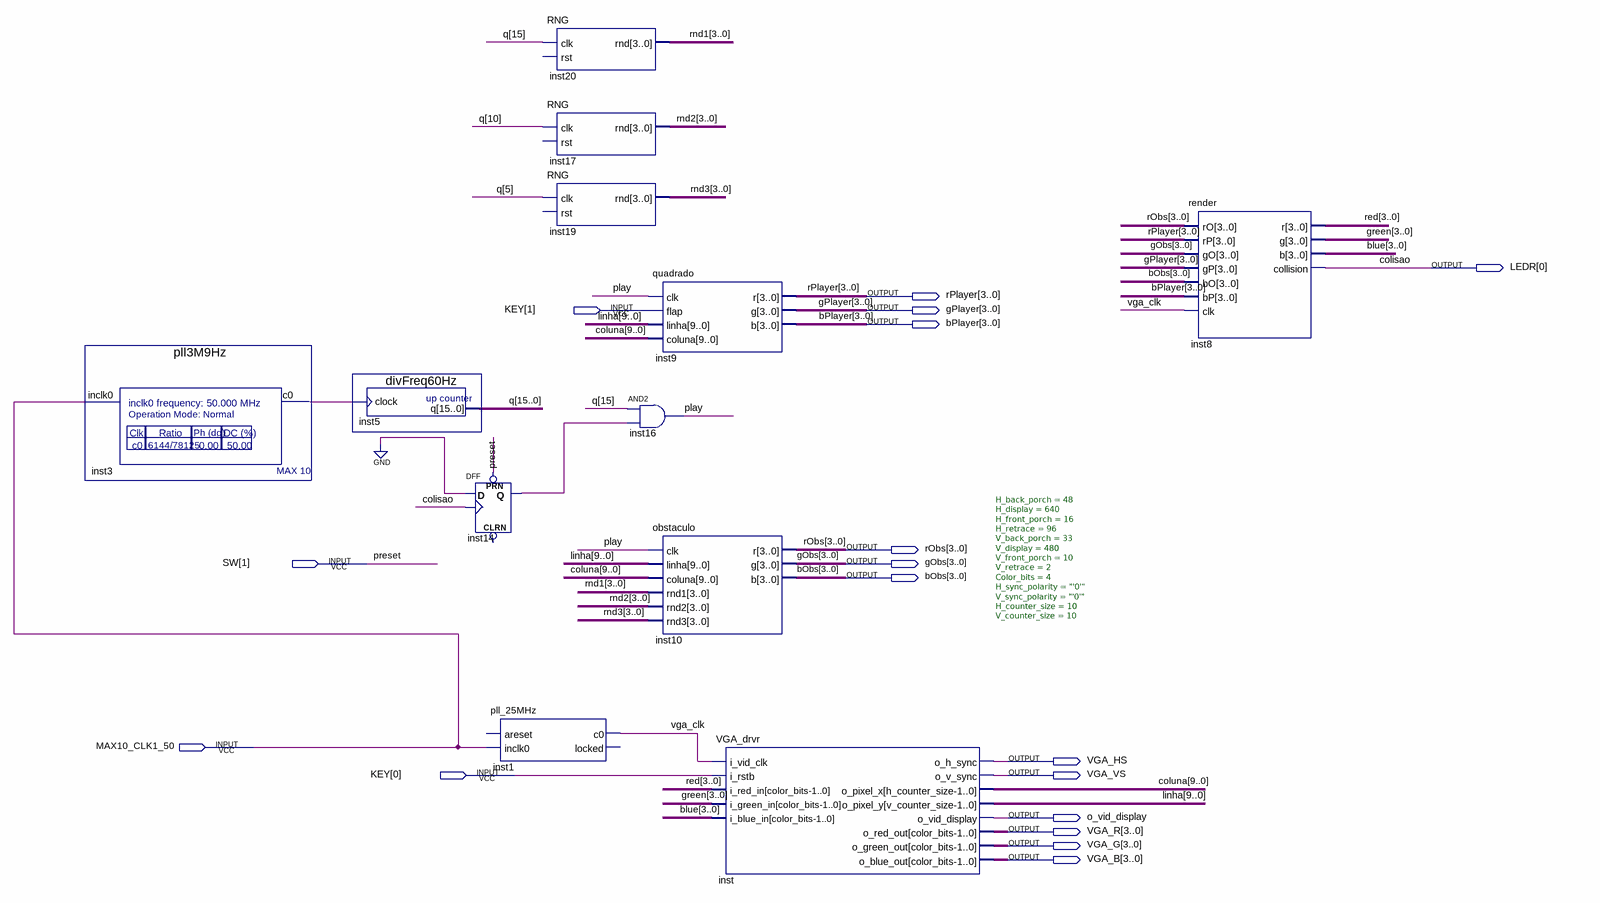
[diagram p0: schematic sheet]
// Quartus schematic vga1.bdf as structural Verilog: 12 symbols, 17 pins
module vga1 (
  input  [1:0] KEY,
  input  [1:1] SW,
  input  MAX10_CLK1_50,
  output [0:0] LEDR,
  output [3:0] rPlayer,
  output [3:0] gPlayer,
  output [3:0] bPlayer,
  output [3:0] rObs,
  output [3:0] gObs,
  output [3:0] bObs,
  output VGA_HS,
  output VGA_VS,
  output o_vid_display,
  output [3:0] VGA_R,
  output [3:0] VGA_G,
  output [3:0] VGA_B
);

  wire inst3_c0, inst14_q, play, vga_clk;
  wire [3:0] blue, green, red, rnd1, rnd2, rnd3;
  wire [9:0] coluna, linha;
  wire [15:0] q;

  pll3M9Hz inst3 (.inclk0(MAX10_CLK1_50), .c0(inst3_c0));
  divFreq60Hz inst5 (.clock(inst3_c0), .q(q));
  DFF inst14 (.CLK(LEDR[0]), .D(1'b0), .PRN(SW[1]), .Q(inst14_q));  // open: CLRN
  pll_25MHz inst1 (.inclk0(MAX10_CLK1_50), .c0(vga_clk));  // open: areset, locked
  RNG inst20 (.clk(q[15]), .rnd(rnd1));  // open: rst
  RNG inst17 (.clk(q[10]), .rnd(rnd2));  // open: rst
  RNG inst19 (.clk(q[5]), .rnd(rnd3));  // open: rst
  quadrado inst9 (.clk(play), .flap(KEY[1]), .linha(linha), .coluna(coluna), .r(rPlayer), .g(gPlayer), .b(bPlayer));
  and inst16 (play, q[15], inst14_q);
  obstaculo inst10 (
    .clk(play), .linha(linha), .coluna(coluna), .rnd1(rnd1), .rnd2(rnd2), .rnd3(rnd3), .r(rObs), .g(gObs),
    .b(bObs));
  VGA_drvr #(.H_back_porch(48), .H_display(640), .H_front_porch(16), .H_retrace(96), .V_back_porch(33), .V_display(480), .V_front_porch(10), .V_retrace(2), .Color_bits(4), .H_sync_polarity("'0'"), .V_sync_polarity("'0'"), .H_counter_size(10), .V_counter_size(10)) inst (
    .i_vid_clk(vga_clk), .i_rstb(KEY[0]), .i_red_in(red), .i_green_in(green), .i_blue_in(blue),
    .o_h_sync(VGA_HS), .o_v_sync(VGA_VS), .o_pixel_x(coluna), .o_pixel_y(linha),
    .o_vid_display(o_vid_display), .o_red_out(VGA_R), .o_green_out(VGA_G), .o_blue_out(VGA_B));
  render inst8 (
    .rO(rObs), .rP(rPlayer), .gO(gObs), .gP(gPlayer), .bO(bObs), .bP(bPlayer), .clk(vga_clk), .r(red),
    .g(green), .b(blue), .collision(LEDR[0]));

  // Other names for the same wires on the sheet: colisao = LEDR[0]; preset = SW[1]
endmodule
